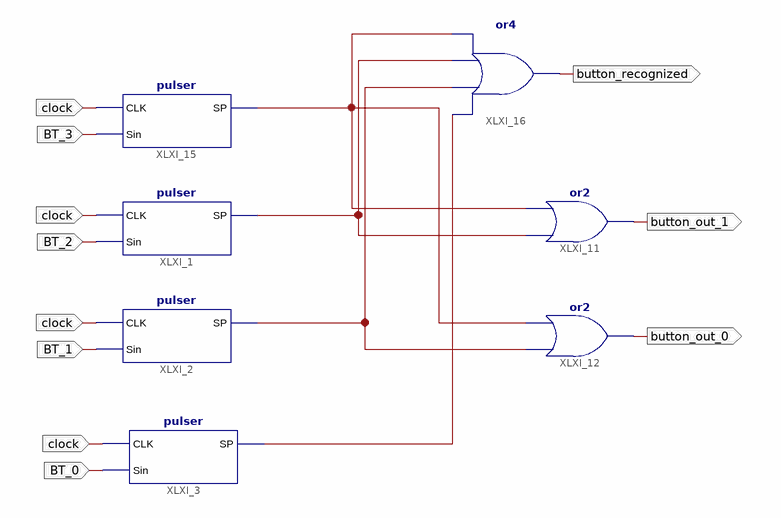
[diagram p0: schematic sheet 1]
// Xilinx ISE schematic button_control.sch (spartan3e) as structural Verilog: 7 symbols, 8 ports
module button_control (
  input  clock,
  input  BT_1,
  input  BT_2,
  input  BT_0,
  input  BT_3,
  output button_recognized,
  output button_out_0,
  output button_out_1
);

  wire XLXN_31, XLXN_32, XLXN_33, XLXN_34;

  pulser XLXI_2 (.CLK(clock), .Sin(BT_1), .SP(XLXN_33));
  pulser XLXI_1 (.CLK(clock), .Sin(BT_2), .SP(XLXN_32));
  pulser XLXI_3 (.CLK(clock), .Sin(BT_0), .SP(XLXN_34));
  or XLXI_11 (button_out_1, XLXN_32, XLXN_31);
  or XLXI_12 (button_out_0, XLXN_33, XLXN_31);
  pulser XLXI_15 (.CLK(clock), .Sin(BT_3), .SP(XLXN_31));
  or XLXI_16 (button_recognized, XLXN_34, XLXN_33, XLXN_32, XLXN_31);
endmodule
